# EAGLE schematic Board_Schamatic08 (EAGLE 9.6.2)
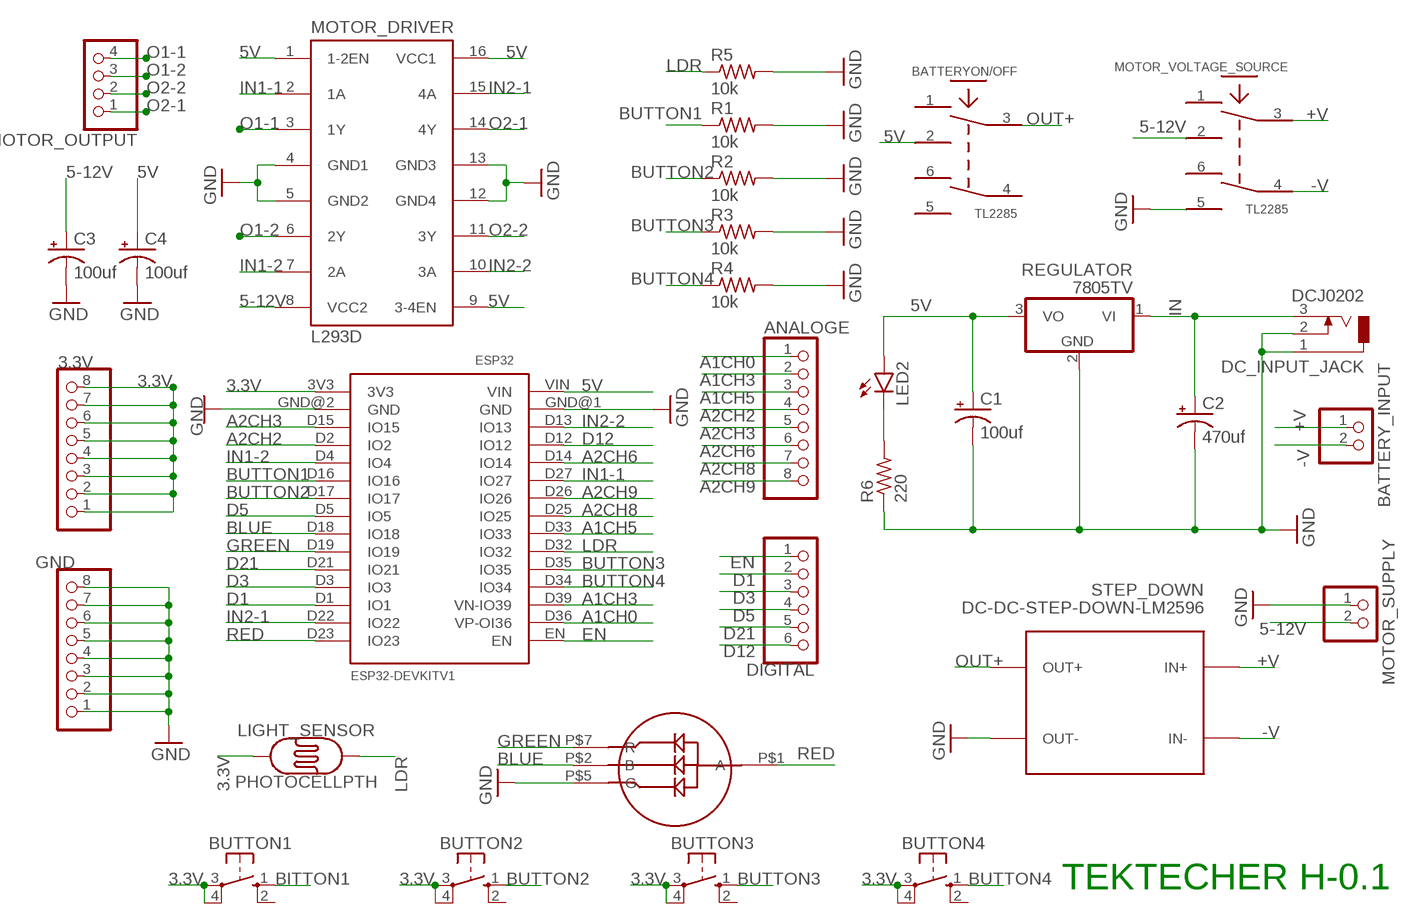
[diagram p0: schematic, sheet 1]

## Parts
3.3V  PINHD-1X8  [1X08]
ANALOGE  PINHD-1X8  [1X08]
BATTERY_INPUT  PINHD-1X2  [1X02]
BATTERYON/OFF  TL2285  [TL2285_PCB]
BUTTON1  10-XX  [B3F-10XX]
BUTTON2  10-XX  [B3F-10XX]
BUTTON3  10-XX  [B3F-10XX]
BUTTON4  10-XX  [B3F-10XX]
C1  100uf  CPOL-USE2-5  [E2-5]
C2  470uf  CPOL-USE2-5  [E2-5]
C3  100uf  CPOL-USE2-5  [E2-5]
C4  100uf  CPOL-USE2-5  [E2-5]
DC_INPUT_JACK  DCJ0202  [DCJ0202]
DIGITAL  PINHD-1X6  [1X06]
ESP32  ESP32DEVKITV1  [ESP32-DEVKITV1]
GND  PINHD-1X8  [1X08]
LED2  LED5MM  [LED5MM]
LIGHT_SENSOR  PHOTOCELLPTH  [PHOTOCELL]
MOTOR_DRIVER  L293D  [DIL16]
MOTOR_OUTPUT  PINHD-1X4  [1X04]
MOTOR_SUPPLY  PINHD-1X2  [1X02]
MOTOR_VOLTAGE_SOURCE  TL2285  [TL2285_PCB]
R1  10k  R-US_0207/10  [0207/10]
R2  10k  R-US_0207/10  [0207/10]
R3  10k  R-US_0207/10  [0207/10]
R4  10k  R-US_0207/10  [0207/10]
R5  10k  R-US_0207/10  [0207/10]
R6  220  R-US_0207/10  [0207/10]
REGULATOR  7805TV  [TO220V]
RGB  LED-4_PIN  [LED-4_PIN]
STEP_DOWN  DC-DC-STEP-DOWN-LM2596  [DC-DC-STEP-DOWN-LM2596]

## Nets
3.3V: 3.3V.1 3.3V.2 3.3V.3 3.3V.4 3.3V.5 3.3V.6 3.3V.7 3.3V.8 BUTTON1.3(P) BUTTON1.4(P1) BUTTON2.3(P) BUTTON2.4(P1) BUTTON3.3(P) BUTTON3.4(P1) BUTTON4.3(P) BUTTON4.4(P1) ESP32.3V3 LIGHT_SENSOR.1
5-12V: C3.+ MOTOR_DRIVER.8(VCC2) MOTOR_SUPPLY.2 MOTOR_VOLTAGE_SOURCE.2
5V: BATTERYON/OFF.2 C1.+ C4.+ ESP32.VIN LED2.A MOTOR_DRIVER.1(1-2EN) MOTOR_DRIVER.9(3-4EN) MOTOR_DRIVER.16(VCC1) REGULATOR.3(VO)
+V: BATTERY_INPUT.1 MOTOR_VOLTAGE_SOURCE.3 STEP_DOWN.IN+
-V: BATTERY_INPUT.2 MOTOR_VOLTAGE_SOURCE.4 STEP_DOWN.IN-
A1CH0: ANALOGE.1 ESP32.D36(VP-OI36)
A1CH3: ANALOGE.2 ESP32.D39(VN-IO39)
A1CH5: ANALOGE.3 ESP32.D33(IO33)
A2CH2: ANALOGE.4 ESP32.D2(IO2)
A2CH3: ANALOGE.5 ESP32.D15(IO15)
A2CH6: ANALOGE.6 ESP32.D14(IO14)
A2CH8: ANALOGE.7 ESP32.D25(IO25)
A2CH9: ANALOGE.8 ESP32.D26(IO26)
BITTON1: BUTTON1.1(S)
BLUE: ESP32.D18(IO18) RGB.P$2(B)
BUTTON1: ESP32.D16(IO16) R1.1
BUTTON2: BUTTON2.1(S) ESP32.D17(IO17) R2.1
BUTTON3: BUTTON3.1(S) ESP32.D35(IO35) R3.1
BUTTON4: BUTTON4.1(S) ESP32.D34(IO34) R4.1
D1: DIGITAL.2 ESP32.D1(IO1)
D3: DIGITAL.3 ESP32.D3(IO3)
D5: DIGITAL.4 ESP32.D5(IO5)
D12: DIGITAL.6 ESP32.D12(IO12)
D21: DIGITAL.5 ESP32.D21(IO21)
EN: DIGITAL.1 ESP32.EN
GND: C1.- C2.- C3.- C4.- DC_INPUT_JACK.1 DC_INPUT_JACK.2 ESP32.GND@1(GND) ESP32.GND@2(GND) GND.1 GND.2 GND.3 GND.4 GND.5 GND.6 GND.7 GND.8 MOTOR_DRIVER.4(GND1) MOTOR_DRIVER.5(GND2) MOTOR_DRIVER.12(GND4) MOTOR_DRIVER.13(GND3) MOTOR_SUPPLY.1 MOTOR_VOLTAGE_SOURCE.5 R1.2 R2.2 R3.2 R4.2 R5.2 R6.1 REGULATOR.2(GND) RGB.P$5(G) STEP_DOWN.OUT-
GREEN: ESP32.D19(IO19) RGB.P$7(R)
IN: C2.+ DC_INPUT_JACK.3 REGULATOR.1(VI)
IN1-1: ESP32.D27(IO27) MOTOR_DRIVER.2(1A)
IN1-2: ESP32.D4(IO4) MOTOR_DRIVER.7(2A)
IN2-1: ESP32.D22(IO22) MOTOR_DRIVER.15(4A)
IN2-2: ESP32.D13(IO13) MOTOR_DRIVER.10(3A)
LDR: ESP32.D32(IO32) LIGHT_SENSOR.2 R5.1
N$4: LED2.K(C) R6.2
O1-1: MOTOR_DRIVER.3(1Y) MOTOR_OUTPUT.4
O1-2: MOTOR_DRIVER.6(2Y) MOTOR_OUTPUT.3
O2-1: MOTOR_DRIVER.14(4Y) MOTOR_OUTPUT.1
O2-2: MOTOR_DRIVER.11(3Y) MOTOR_OUTPUT.2
OUT+: BATTERYON/OFF.3 STEP_DOWN.OUT+
RED: ESP32.D23(IO23) RGB.P$1(A)
Unconnected: BATTERYON/OFF.1 BATTERYON/OFF.4 BATTERYON/OFF.5 BATTERYON/OFF.6 BUTTON1.2(S1) BUTTON2.2(S1) BUTTON3.2(S1) BUTTON4.2(S1) MOTOR_VOLTAGE_SOURCE.1 MOTOR_VOLTAGE_SOURCE.6

## Notes on the sheet
- TEKTECHER H-01
- TEKTECHER H-0.1

## Library data of the parts
3.3V ANALOGE GND = pinhead:PINHD-1X8: PIN HEADER
BATTERY_INPUT MOTOR_SUPPLY = pinhead:PINHD-1X2: PIN HEADER
BATTERYON/OFF MOTOR_VOLTAGE_SOURCE = L71_devices:TL2285: E-Switch TL2285 (PCB switch)
BUTTON1-BUTTON4 = switch-omron:10-XX: OMRON SWITCH; MPN: B3F-1000; OC_FARNELL: 176432; OC_NEWARK: 36M3542
C1-C4 = rcl:CPOL-US: POLARIZED CAPACITOR, American symbol; SPICEPREFIX: C
DC_INPUT_JACK = con-jack:DCJ0202: DC POWER JACK Source: DCJ0202.pdf; OC_FARNELL: unknown; OC_NEWARK: unknown
DIGITAL = pinhead:PINHD-1X6: PIN HEADER
ESP32 = ESP32-DEVKITV1:ESP32DEVKITV1
LED2 = led:LED: LED OSRAM: - CHIPLED LG R971, LG N971, LY N971, LG Q971, LY Q971, LO R971, LY R971 LH N974, LH R974 LS Q976, LO Q976, LY Q976 LO Q996 - Hyper CHIPLED LW Q18S LB Q993, LB Q99A, LB R99A - SideLED LS A670, LO A670, LY A670, LG A670, LP A670 LB A673, LV A673, LT A673, LW A673 LH A674 LY A675 LS A676, LA A676, LO A676, LY A676, LW A676 LS A679, LY A679, LG A679 - Hyper Micro SIDELED® LS Y876, LA Y876, LO Y876, LY Y876 LT Y87S - SmartLED LW L88C, LW L88S LB L89C, LB L89S, LG L890 LS L89K, LO L89K, LY L89K LS L896, LA L896, LO L896, LY L896 - TOPLED LS T670, LO T670, LY T670, LG T670, LP T670 LSG T670, LSP T670, LSY T670, LOP T670, LYG T670 LG T671, LOG T671, LSG T671 LB T673, LV T673, LT T673, LW T673 LH T674 LS T676, LA T676, LO T676, LY T676, LB T676, LH T676, LSB T676, LW T676 LB T67C, LV T67C, LT T67C, LS T67K, LO T67K, LY T67K, LW E67C LS E67B, LA E67B, LO E67B, LY E67B, LB E67C, LV E67C, LT E67C LW T67C LS T679, LY T679, LG T679 LS T770, LO T770, LY T770, LG T770, LP T770 LB T773, LV T773, LT T773, LW T773 LH T774 LS E675, LA E675, LY E675, LS T675 LS T776, LA T776, LO T776, LY T776, LB T776 LHGB T686 LT T68C, LB T68C - Hyper Mini TOPLED® LB M676 - Mini TOPLED Santana® LG M470 LS M47K, LO M47K, LY M47K Source: http://www.osram.convergy.de LUXEON: - LUMILED® LXK2-PW12-R00, LXK2-PW12-S00, LXK2-PW14-U00, LXK2-PW14-V00 LXK2-PM12-R00, LXK2-PM12-S00, LXK2-PM14-U00 LXK2-PE12-Q00, LXK2-PE12-R00, LXK2-PE12-S00, LXK2-PE14-T00, LXK2-PE14-U00 LXK2-PB12-K00, LXK2-PB12-L00, LXK2-PB12-M00, LXK2-PB14-N00, LXK2-PB14-P00, LXK2-PB14-Q00 LXK2-PR12-L00, LXK2-PR12-M00, LXK2-PR14-Q00, LXK2-PR14-R00 LXK2-PD12-Q00, LXK2-PD12-R00, LXK2-PD12-S00 LXK2-PH12-R00, LXK2-PH12-S00 LXK2-PL12-P00, LXK2-PL12-Q00, LXK2-PL12-R00 Source: www.luxeon.com KINGBRIGHT: KA-3528ASYC Source: www.kingbright.com
LIGHT_SENSOR = SparkFun-Sensors:PHOTOCELL: Photocell (Photodetector, Photo Resistor, CdS) This is a very small light sensor. A photocell changes (also called a photodetector, photo resistor, CdS or photoconductive cell) resistance depending on the amount of light it is exposed to. These little sensors make great ambient light triggers (when light in the room turns on, do something). Datasheet <http://cdn.sparkfun.com/datasheets/Sensors/LightImaging/SEN-09088.pdf> SparkFun Products Mini Photocell <https://www.sparkfun.com/products/9088> (SEN-09088); PROD_ID: COMP-09129; SF_ID: SEN-09088
MOTOR_DRIVER = st-microelectronics:L293D: PUSH-PULL 4 CHANNEL DRIVER; MPN: L293D; OC_FARNELL: 9589619; OC_NEWARK: 56P8249
MOTOR_OUTPUT = pinhead:PINHD-1X4: PIN HEADER
R1-R6 = rcl:R-US_: RESISTOR, American symbol; SPICEPREFIX: R
REGULATOR = linear:78*: Positive VOLTAGE REGULATOR Source: http://cache.national.com/ds/LM/LM78L05.pdf http://www.fairchildsemi.com/ds/LM/LM7805.pdf
RGB = RGB-Led:LED-4_PIN
STEP_DOWN = diy-modules:DC-DC-STEP-DOWN-LM2596: DC/DC Step-Down Regulator based on LM2596-ADJ chip LM2596 datasheet available here: http://www.ti.com/lit/ds/symlink/lm2596.pdf Click here to find device on ebay.com <http://www.ebay.com/sch/lm2596+power+regulator>